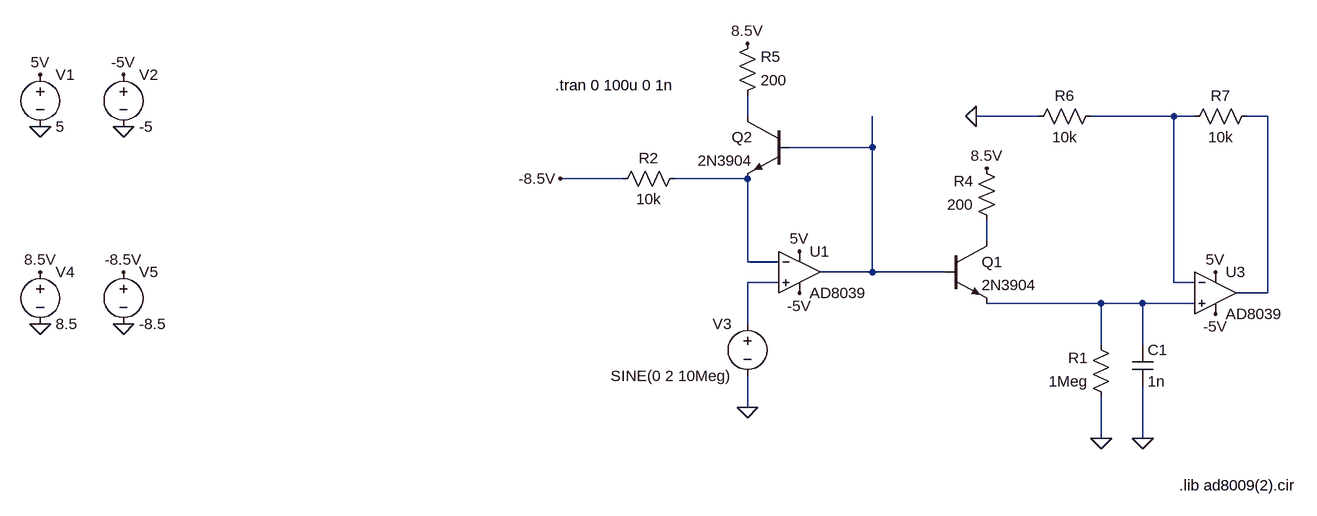
[diagram p0: schematic teste.asc]
teste.asc, the LTspice schematic file:
Version 4
SHEET 1 1232 680
WIRE 80 32 80 0
WIRE 528 32 432 32
WIRE 736 32 608 32
WIRE 768 32 736 32
WIRE 880 32 848 32
WIRE 272 80 272 32
WIRE 272 80 144 80
WIRE -112 128 -208 128
WIRE 80 128 -32 128
WIRE 448 224 448 192
WIRE 80 256 80 128
WIRE 128 256 80 256
WIRE 272 272 272 80
WIRE 272 272 192 272
WIRE 384 272 272 272
WIRE 128 288 80 288
WIRE 736 288 736 32
WIRE 768 288 736 288
WIRE 880 304 880 32
WIRE 880 304 832 304
WIRE 624 320 448 320
WIRE 688 320 624 320
WIRE 768 320 688 320
WIRE 80 352 80 288
WIRE 624 384 624 320
WIRE 688 384 688 320
WIRE 80 480 80 432
WIRE 624 528 624 464
WIRE 688 528 688 448
FLAG -1008 48 0
FLAG 160 240 5V
FLAG -1008 -32 5V
FLAG -880 48 0
FLAG -880 -32 -5V
FLAG 160 304 -5V
FLAG 624 528 0
FLAG 688 528 0
FLAG 80 480 0
FLAG 800 272 5V
FLAG 800 336 -5V
FLAG -1008 352 0
FLAG -1008 272 8.5V
FLAG -880 352 0
FLAG -880 272 -8.5V
FLAG 448 112 8.5V
FLAG 80 -80 8.5V
FLAG -208 128 -8.5V
FLAG 432 32 0
SYMBOL voltage -1008 -48 R0
WINDOW 123 0 0 Left 0
WINDOW 39 0 0 Left 0
SYMATTR InstName V1
SYMATTR Value 5
SYMBOL voltage -880 -48 R0
WINDOW 123 0 0 Left 0
WINDOW 39 0 0 Left 0
SYMATTR InstName V2
SYMATTR Value -5
SYMBOL res 640 480 R180
WINDOW 0 36 76 Left 2
WINDOW 3 36 40 Left 2
SYMATTR InstName R1
SYMATTR Value 1Meg
SYMBOL cap 672 384 R0
SYMATTR InstName C1
SYMATTR Value 1n
SYMBOL voltage 80 336 M0
WINDOW 123 0 0 Left 0
WINDOW 39 0 0 Left 0
SYMATTR InstName V3
SYMATTR Value SINE(0 2 10Meg)
SYMBOL OpAmps\\AD8039 800 240 R0
SYMATTR InstName U3
SYMBOL npn 384 224 R0
SYMATTR InstName Q1
SYMATTR Value 2N3904
SYMBOL voltage -1008 256 R0
WINDOW 123 0 0 Left 0
WINDOW 39 0 0 Left 0
SYMATTR InstName V4
SYMATTR Value 8.5
SYMBOL voltage -880 256 R0
WINDOW 123 0 0 Left 0
WINDOW 39 0 0 Left 0
SYMATTR InstName V5
SYMATTR Value -8.5
SYMBOL res 464 208 R180
WINDOW 0 36 76 Left 2
WINDOW 3 36 40 Left 2
SYMATTR InstName R4
SYMATTR Value 200
SYMBOL npn 144 32 M0
SYMATTR InstName Q2
SYMATTR Value 2N3904
SYMBOL res 64 16 M180
WINDOW 0 36 76 Left 2
WINDOW 3 36 40 Left 2
SYMATTR InstName R5
SYMATTR Value 200
SYMBOL res -16 112 R90
WINDOW 0 0 56 VBottom 2
WINDOW 3 32 56 VTop 2
SYMATTR InstName R2
SYMATTR Value 10k
SYMBOL res 624 16 R90
WINDOW 0 0 56 VBottom 2
WINDOW 3 32 56 VTop 2
SYMATTR InstName R6
SYMATTR Value 10k
SYMBOL res 864 16 R90
WINDOW 0 0 56 VBottom 2
WINDOW 3 32 56 VTop 2
SYMATTR InstName R7
SYMATTR Value 10k
SYMBOL OpAmps\\AD8039 160 208 R0
SYMATTR InstName U1
TEXT -216 -16 Left 2 !.tran 0 100u 0 1n
TEXT 744 600 Left 2 !.lib ad8009(2).cir

The netlist it stands for:
* teste.asc
V1 5V 0 5
V2 -5V 0 -5
R1 0 N008 1Meg
C1 N008 0 1n
V3 N007 0 SINE(0 2 10Meg)
XU3 N008 N002 5V -5V N003 AD8039  ; pins In+ In- V+ V- OUT
Q1 N006 N004 N008 0 2N3904
V4 8.5V 0 8.5
V5 -8.5V 0 -8.5
R4 N006 8.5V 200
Q2 N001 N004 N005 0 2N3904
R5 N001 8.5V 200
R2 N005 -8.5V 10k
R6 N002 0 10k
R7 N003 N002 10k
XU1 N007 N005 5V -5V N004 AD8039  ; pins In+ In- V+ V- OUT
.model NPN NPN
.model PNP PNP
.lib standard.bjt
.tran 0 100u 0 1n
.lib ad8009(2).cir
.backanno
.end